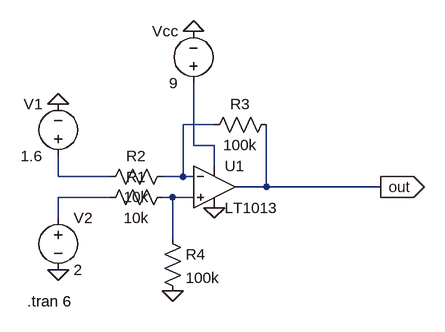
[diagram p0: schematic Amplificator Diferential.asc]
Amplificator Diferential.asc, the LTspice schematic file:
Version 4.1
SHEET 1 880 680
WIRE 160 48 112 48
WIRE 128 80 128 -16
WIRE 160 80 128 80
WIRE 160 112 160 80
WIRE -80 128 -80 96
WIRE 0 128 -80 128
WIRE 112 128 112 48
WIRE 112 128 80 128
WIRE 128 128 112 128
WIRE 240 144 240 48
WIRE 240 144 192 144
WIRE 416 144 240 144
WIRE 0 160 -80 160
WIRE 96 160 80 160
WIRE 128 160 96 160
WIRE -80 192 -80 160
WIRE 96 224 96 160
FLAG 128 -96 0
FLAG 160 176 0
FLAG -80 272 0
FLAG -80 16 0
FLAG 416 144 out
IOPIN 416 144 Out
FLAG 96 304 0
SYMBOL OpAmps\\LT1013 160 80 R0
SYMATTR InstName U1
SYMBOL res 96 144 R90
WINDOW 0 0 56 VBottom 2
WINDOW 3 32 56 VTop 2
SYMATTR InstName R1
SYMATTR Value 10k
SYMBOL res 96 112 R90
WINDOW 0 0 56 VBottom 2
WINDOW 3 32 56 VTop 2
SYMATTR InstName R2
SYMATTR Value 10k
SYMBOL res 80 208 R0
SYMATTR InstName R4
SYMATTR Value 100k
SYMBOL res 256 32 R90
WINDOW 0 0 56 VBottom 2
WINDOW 3 32 56 VTop 2
SYMATTR InstName R3
SYMATTR Value 100k
SYMBOL voltage 128 0 R180
WINDOW 0 24 96 Left 2
WINDOW 3 24 16 Left 2
WINDOW 123 0 0 Left 0
WINDOW 39 0 0 Left 0
SYMATTR InstName Vcc
SYMATTR Value 9
SYMBOL voltage -80 112 R180
WINDOW 0 24 96 Left 2
WINDOW 3 24 16 Left 2
WINDOW 123 0 0 Left 0
WINDOW 39 0 0 Left 0
SYMATTR InstName V1
SYMATTR Value 1.6
SYMBOL voltage -80 176 R0
WINDOW 123 0 0 Left 0
WINDOW 39 0 0 Left 0
SYMATTR InstName V2
SYMATTR Value 2
TEXT -128 320 Left 2 !.tran 6

The netlist it stands for:
* Amplificator Diferential.asc
X§U1 N005 N001 N002 0 out LT1013  ; pins In+ In- V+ V- OUT
R1 N005 N004 10k
R2 N001 N003 10k
R4 N005 0 100k
R3 out N001 100k
Vcc N002 0 9
V1 N003 0 1.6
V2 N004 0 2
.tran 6
.lib LTC.lib
.backanno
.end